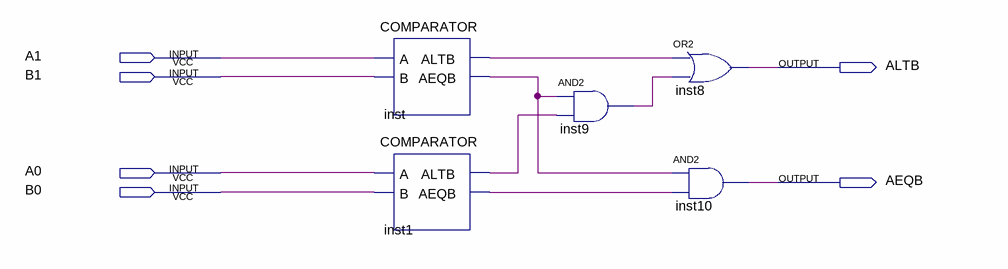
[diagram p0: schematic sheet]
// Quartus schematic COMPARATOR2.bdf as structural Verilog: 5 symbols, 6 pins
module COMPARATOR2 (
  input  A1,
  input  B1,
  input  A0,
  input  B0,
  output ALTB,
  output AEQB
);

  wire inst1_aeqb, inst1_altb, inst9_out, inst_aeqb, inst_altb;

  COMPARATOR inst (.A(A1), .B(B1), .ALTB(inst_altb), .AEQB(inst_aeqb));
  COMPARATOR inst1 (.A(A0), .B(B0), .ALTB(inst1_altb), .AEQB(inst1_aeqb));
  and inst9 (inst9_out, inst_aeqb, inst1_altb);
  or inst8 (ALTB, inst_altb, inst9_out);
  and inst10 (AEQB, inst_aeqb, inst1_aeqb);
endmodule
